# Altium schematic sheet 5VBuch_RUDRV2.SchDoc
size 431 x 279 mm; SheetNumber: 2; SheetTotal: 2
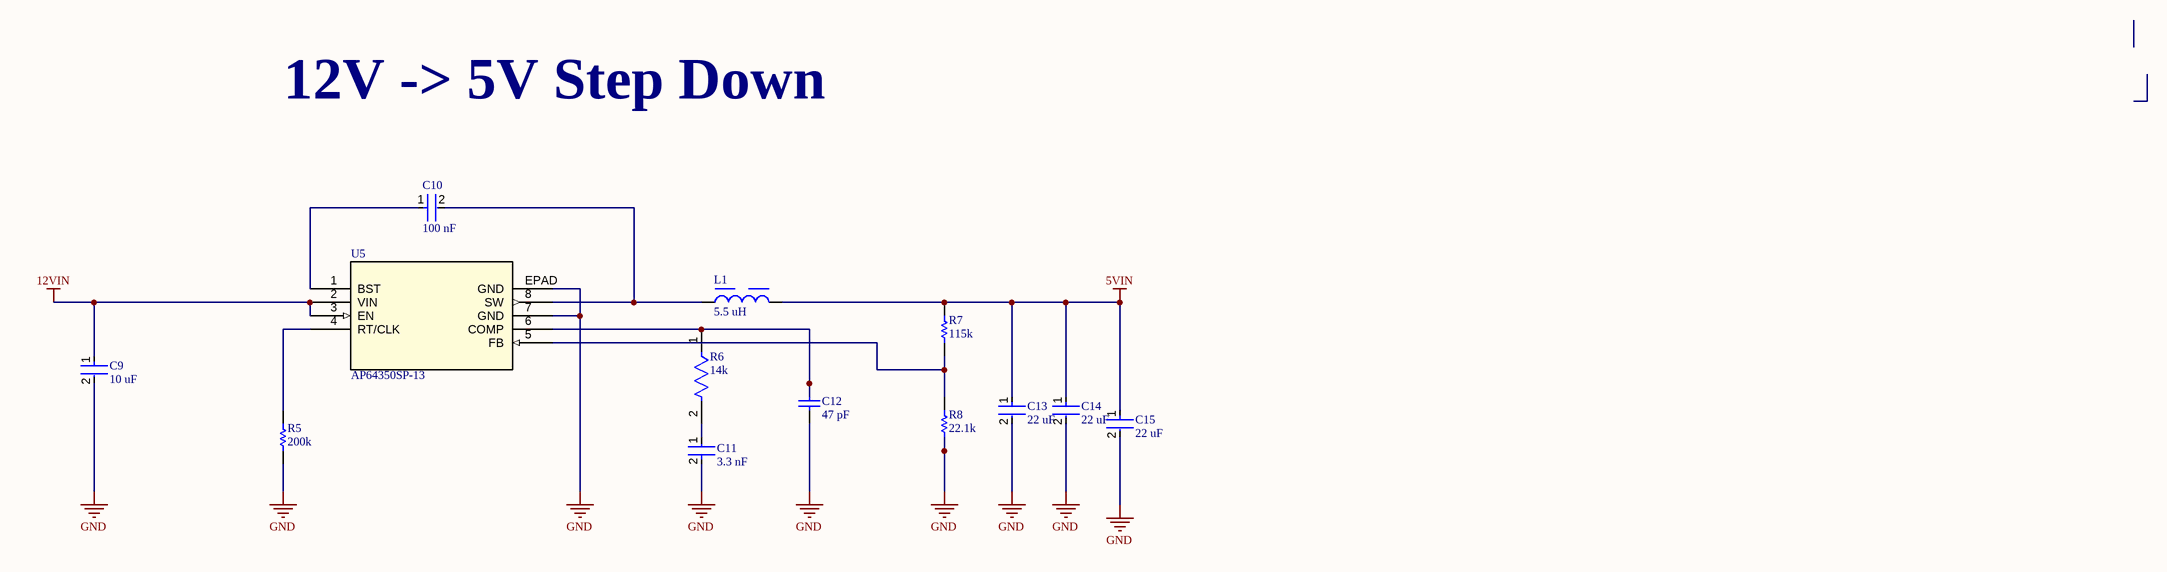
[diagram p0: 5VBuch_RUDRV2.SchDoc]

## Parts
C9  10 uF  [FP-GRM21B-0_1-IPC_C]
C10  100 nF  [FP-0805-L_2_01_0_2-W_1_25-IPC_B]
C11  3.3 nF  [FP-GRM216-0_1-IPC_B]
C12  47 pF  [CAPC2013X135X50NL15T20]
C13  22 uF  [FP-GRM21B-0_15-MFG]
C14  22 uF  [FP-GRM21B-0_15-MFG]
C15  22 uF  [FP-GRM21B-0_15-MFG]
L1  5.5 uH  [WE-HCI_1050]
R5  200k  [RESC2013X70X40ML20T20]
R6  14k  [FP-CRCW0805-e3-MFG]
R7  115k  [RESC2013X50X30LL20T20]
R8  22.1k  [RESC2013X70X40NL20T20]
U5  AP64350SP-13  [SO-8EP_DIO]

## Nets
5VIN: C13.1 C14.1 C15.1 L1.2 R7.2
12VIN: C9.1 U5.2(VIN) U5.3(EN)
GND: C9.2 C11.2 C12.1 C13.2 C14.2 C15.2 R5.1 R8.1 U5.7(GND) U5.EPAD(GND)
NetC10_1: C10.1 U5.1(BST)
NetC10_2: C10.2 L1.1 U5.8(SW)
NetC11_1: C11.1 R6.2
NetC12_2: C12.2 R6.1 U5.6(COMP)
NetR5_2: R5.2 U5.4(RT/CLK)
NetR7_1: R7.1 R8.2 U5.5(FB)

## Notes on the sheet
- 12V -> 5V Step Down
- DWG. NO.
- REV.
- SHT.
- THIS DOCUMENT AND THE DATA DISCLOSED HEREIN OR HEREWITH IS THE PROPERTY OF ALTIUM LIMITED AND MAY BE FREELY DISTRIBUTED IN WHOLE. NO RIGHTS ARE RESERVED OR EXPRESS OR IMPLIED WARANTEE GIVEN.
- REVISION
- DESCRIPTION
- DATE
- APPROVED
- ENG:
- APPROVALS
- PROJECT
- DSN:
- CHK:
- REFERENCE DOCUMENTS
- PROJECT REVISION:
- TITLE
- DOCUMENT REVISION:
- DESIGN ITEM:
- BOM:
- FAB DWG:
- PCB DWG:
- ASSY DWG:
- SCALE:
- SIZE
- B
- CAGE CODE
- FILE NAME
- DWG NO.
- SHEET
- OF
- REV

## Library data of the parts
C9 = CMP-2007-03453-2: Chip Multilayer Ceramic Capacitors for General Purpose, 0805, 10uF, X5R, 15%, 10%, 16V; Radiation Hardening: No; Thickness: 0.053inch; Voltage Rating (DC): 16V; Lead Free: Lead Free; Package Quantity: 1; Width: 1.25mm; Case Code (Imperial): 0805; Depth: 1.25mm; Packaging: Tape and Reel; Dielectric: X5R; Max Operating Temperature: 85°C; Tolerance: 10%; Voltage Rating: 16V; Voltage: 16V; Capacitance: 10uF; Height: 1.25mm; Case Code (Metric): 2012; Material: Ceramic; Mount: Surface Mount; Case/Package: 0805; REACH SVHC: No SVHC; Length: 2mm; Min Operating Temperature: -55°C; Termination: SMD/SMT
C10 = CMP-2007-04172-2: Automotive Ceramic Capacitor, 0805, 100nF, 10%, X7R, 15%, 100V; Voltage Rating (DC): 100V; Case Code (Metric): 2012; Mount: Surface Mount; Length: 2.01mm; Depth: 1.25mm; Lead Free: Lead Free; Ratings: AEC-Q200; Max Operating Temperature: 125°C; Tolerance: 10%; Case/Package: 0805; Width: 0.049inch; Package Quantity: 1; Thickness: 0.055inch; Construction: Flat; Min Operating Temperature: -55°C; REACH SVHC: No SVHC; Number of Pins: 2; Radiation Hardening: No; Capacitance: 100nF; Voltage Rating: 100V; Height: 1.4mm; Series: -; Voltage: 100V; Dielectric: X7R; Termination: SMD/SMT; Case Code (Imperial): 0805; RoHS Compliant: Yes; Packaging: Tape and Reel; Dielectric Material: Ceramic
C11 = CMP-2007-00889-2: Chip Multilayer Ceramic Capacitors for General Purpose, 0805, 3300pF, C0G, 30ppm/°C, 5%, 50V; Insulation Resistance: 10GR; Capacitance: 3.3nF; Mount: Surface Mount; Case/Package: 0805; Case Code (Imperial): 0805; Lead Free: Lead Free; RoHS Compliant: Yes; Dielectric: C0G; Material: Ceramic; Size: 0.6mm; Voltage Rating (DC): 50V; Voltage: 50V; Termination: SMD/SMT; Case Code (Metric): 2012; Construction: Flat; Max Operating Temperature: 125°C; Series: GRM; Min Operating Temperature: -55°C; Temperature Coefficient: 30ppm/°C; Packaging: Tape and Reel; Height: 0.6mm; REACH SVHC: No SVHC; Width: 0.049inch; Length: 2mm; Thickness: 0.028inch; Voltage Rating: 50V; Tolerance: 5%; Number of Pins: 2; Package Quantity: 1; Dielectric Material: Ceramic; Depth: 1.25mm
C12 = CMP-1036-01617-2: Part Number: VJ0805A470JXACW1BC; Manufacturer: Vitramon
C13-C15 = CMP-2007-03385-2: Chip Multilayer Ceramic Capacitors for General Purpose, 0805, 22uF, X5R, 15%, 20%, 6.3V; Material: Ceramic; Max Operating Temperature: 85°C; Voltage: 6.3V; Min Operating Temperature: -55°C; Case/Package: 0805; Thickness: 0.053inch; Dielectric: X5R; Packaging: Tape and Reel; Depth: 1.25mm; Termination: SMD/SMT; Voltage Rating (DC): 6.3V; Radiation Hardening: No; Tolerance: 20%; Mount: Surface Mount; Lead Free: Lead Free; Package Quantity: 1; REACH SVHC: No SVHC; Voltage Rating: 6.3V; Capacitance: 22uF; Length: 2mm; Case Code (Imperial): 0805; Case Code (Metric): 2012; Width: 0.049inch; Height: 1.25mm
L1 = CMP-0226-00138-2: NexarPartId: 7866439; Shielding: Shielded; Series Resistance: 10.3Ω; Inductance: 5.5µH; Inductance Tolerance: 20%; Current Rating: 10A; DC Resistance (DCR): 10.3mΩ; Self Resonant Frequency: 30MHz; Saturation Current: 12A; Test Frequency: 100kHz; Max Operating Temperature: 150°C; Case/Package: 1050; Lead Free: Lead Free; Number of Pins: 2; Ambient Temperature Range High: 100°C; Height: 4.7mm; Mount: Surface Mount; Composition: Wirewound; Ambient Temperature Range Low: -40°C; RoHS: Compliant; Length: 10.5mm; Max DC Current: 10A; RMS Current (Irms): 10A; Width: 10.2mm; Resistance: 10.3mΩ; Packaging: Cut Tape (CT); Tolerance: 20%; Height - Seated (Max): 5.0038mm; REACH SVHC: Unknown; Depth: 10.2mm; Min Operating Temperature: -40°C; Termination: SMD/SMT
R5 = CMP-2001-00372-1: Part Number: ERJ-6GEYJ204V; Manufacturer: Panasonic
R6 = CMP-2001-04956-2: RES Thick Film, 14kΩ, 1%, 0.125W, 100ppm/°C, 0805; Voltage Rating: 150V; Max Power Dissipation: 125mW; Resistance: 14kR; Temperature Coefficient: 100ppm/°C; Radiation Hardening: No; Number of Terminations: 2; Lead Free: Lead Free; Depth: 1.25mm; Height: 0.45mm; Case Code (Imperial): 0805; Packaging: Tape and Reel; Termination: SMD/SMT; Military Standard: Not; Length: 2mm; Working Voltage: 150V; Contact Plating: Tin; Power Rating: 125mW; Case/Package: 0805; Case Code (Metric): 2012; Weight: 0.000194oz; Features: Automotive AEC-Q200; Width: 1.25mm; Package Quantity: 10; Voltage Rating (DC): 150V; Mount: Surface Mount; Tolerance: 1%; Composition: Thick Film; Min Operating Temperature: -55°C; Max Operating Temperature: 155°C; Number of Pins: 2
R7 = CMP-2001-04921-1: Manufacturer: Vishay Dale; Part Number: CRCW0805115KFKEA
R8 = CMP-2001-00049-1: Part Number: ERJ-6ENF2212V; Manufacturer: Panasonic
U5 = AP64350SP-13: No Description Available; Mfr_Name: Diodes Inc; RefDes: RefDes; Type: Type